# EAGLE schematic MTC2-N9151-BRK rev2-2 (Eagle) (EAGLE 7.5.0)
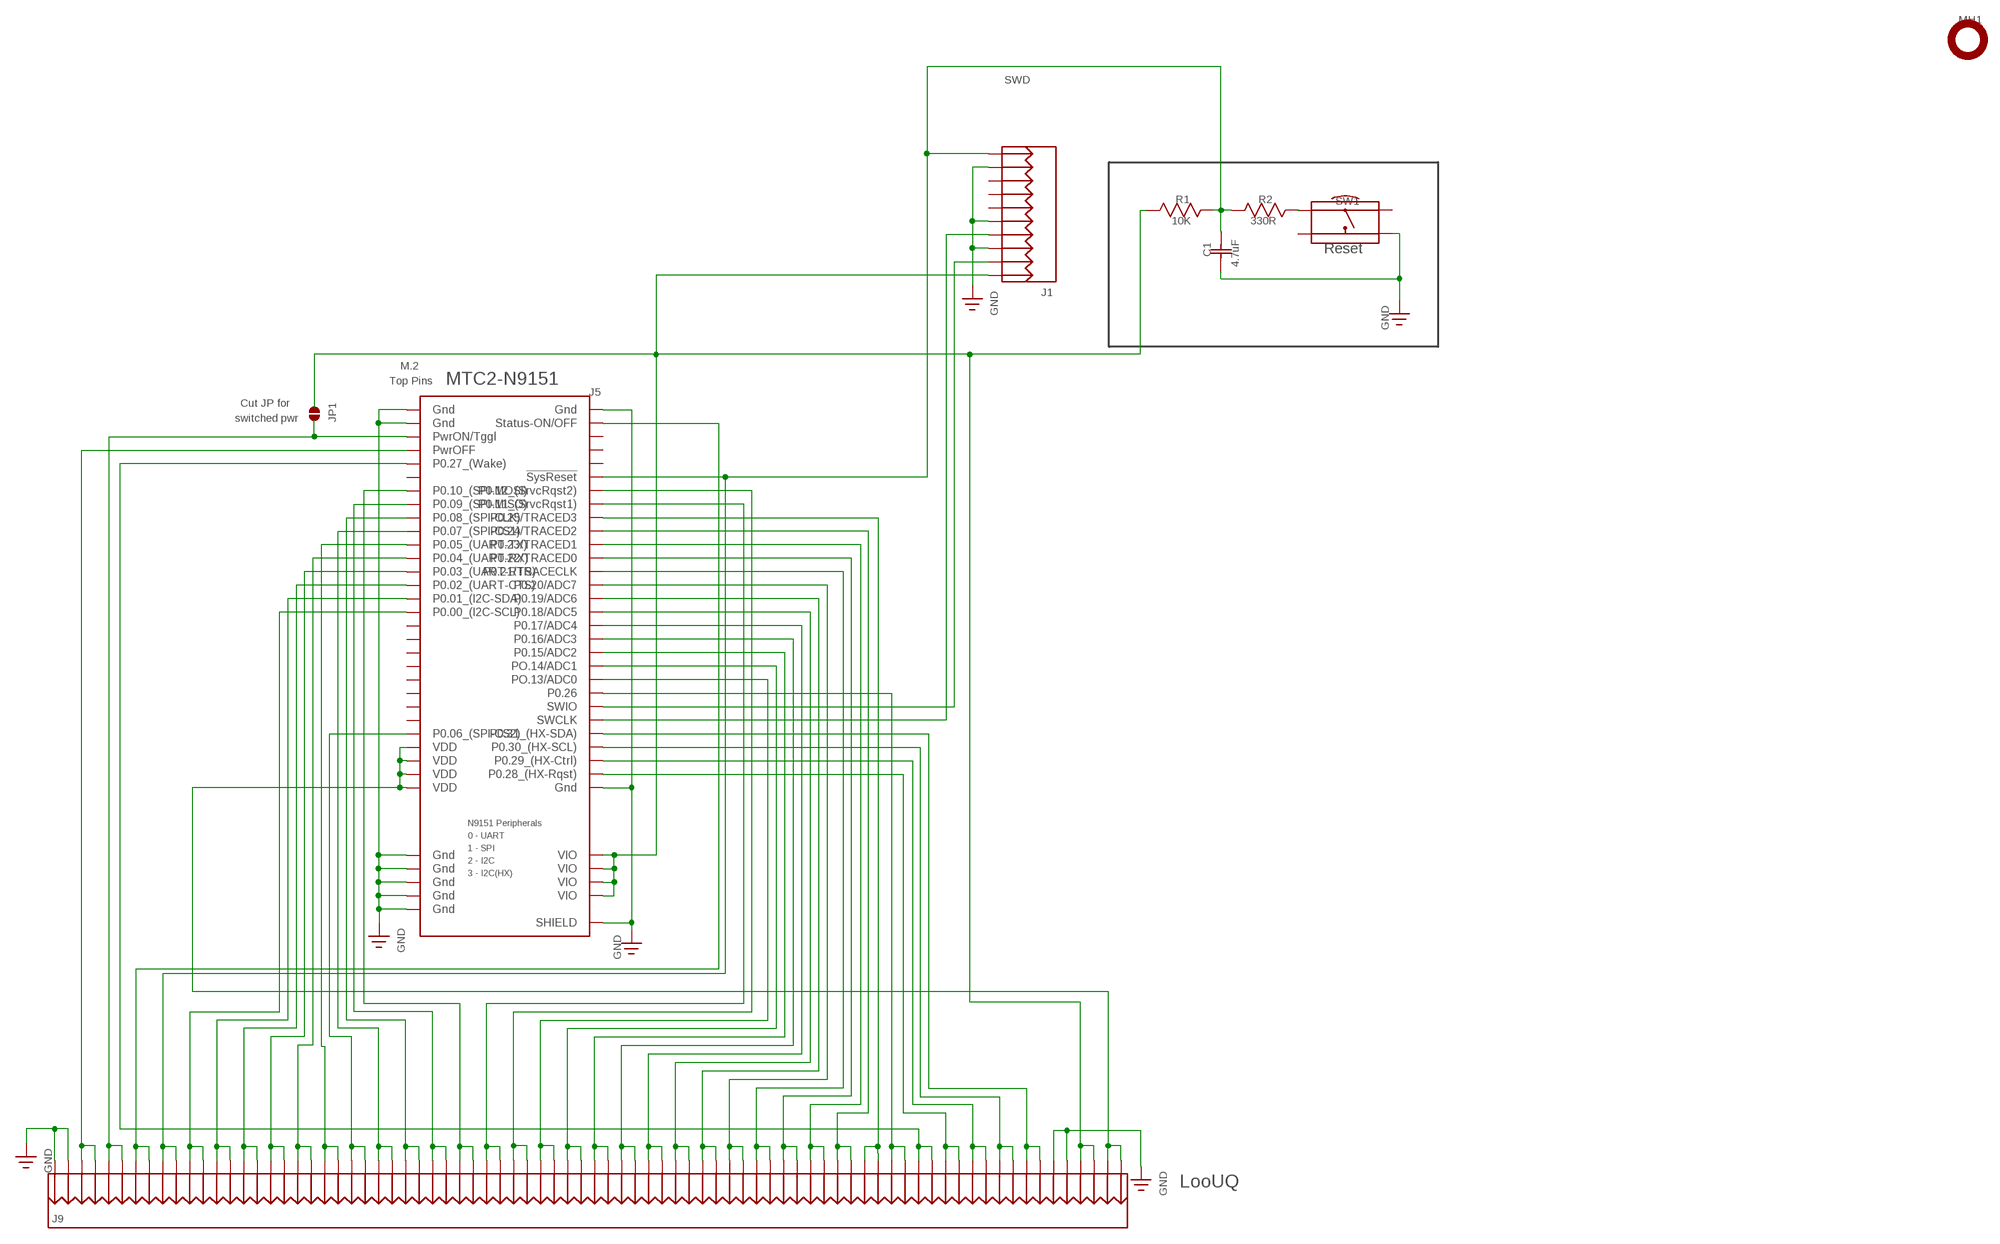
[diagram p0: schematic, sheet 1]

## Parts
C1  4.7uF  CL10A475KP8NNNC  [CAP_0603]
J1  CNCTECH_3220-10-0300-00-TR  [CNCTECH_3220-10-0300-00-TR]
J5  MTC.2_1-2199230-6_(N9151)  [TE_1-2199230-6]
J9  90131-0160  [HDR-2X40T/2.54X2.54/102X5]
JP1  CIRCJUMPER-2  [CIRC-JUMPER-2]
LG1  LOOUQ_LOGO  [LOOUQ-6MM]
MH1  9774025151R  [M.2_STANDOFF]
R1  10K  RNCP0603FTD10K0  [RES_0603]
R2  330R  WR06X3300FTL  [RES_0603]
SW1  KMR221GLFS  [KMR-2-WG]

## Nets
ND_RESETSW: R2.2 SW1.1@_1
Net_GND: C1.1 J1.3 J1.5 J1.9 J5.1(Gnd) J5.2(Gnd) J5.3(Gnd) J5.58(Gnd) J5.67(Gnd) J5.69(Gnd) J5.71(Gnd) J5.73(Gnd) J5.75(Gnd) J5.S1(SHIELD) J5.S2(SHIELD) J9.1 J9.2 J9.75 J9.76 SW1.2@_1 ; supply symbol labelled GND
Net_PWR-TGL: J5.5(PwrON/Tggl) J9.5 J9.6 JP1.1
Net_SWCLK: J1.4 J5.48(SWCLK)
Net_SWIO: J1.2 J5.46(SWIO)
Net_VDD: J5.51(VDD) J5.53(VDD) J5.55(VDD) J5.57(VDD) J9.79 J9.80
Net_VIO [NetClass2]: J1.1 J5.68(VIO) J5.70(VIO) J5.72(VIO) J5.74(VIO) J9.77 J9.78 JP1.2 R1.2
nSysReset: C1.2 J1.10 J5.12(!SysReset) J9.9 J9.10 R1.1 R2.1
P0.01_(I2C-SCL): J5.31(P0.00_(I2C-SCL)) J9.11 J9.12
P0.01_(I2C-SDA): J5.29(P0.01_(I2C-SDA)) J9.13 J9.14
P0.02_(UART-CTS): J5.27(P0.02_(UART-CTS)) J9.15 J9.16
P0.03_(UART-RTS): J5.25(P0.03_(UART-RTS)) J9.17 J9.18
P0.04_(UART-RX): J5.23(P0.04_(UART-RX)) J9.19 J9.20
P0.05_(UART-TX): J5.21(P0.05_(UART-TX)) J9.21 J9.22
P0.06_(SPI-CS2): J5.49(P0.06_(SPI-CS2)) J9.23 J9.24
P0.07_(SPI-CS1): J5.19(P0.07_(SPI-CS1)) J9.25 J9.26
P0.08_(SPI-CLK): J5.17(P0.08_(SPI-CLK)) J9.27 J9.28
P0.09_(SPI-MISO): J5.15(P0.09_(SPI-MISO)) J9.29 J9.30
P0.10_(SPI-MOSI): J5.13(P0.10_(SPI-MOSI)) J9.31 J9.32
P0.11_(nSrvcRqst1): J5.16(P0.11_(SrvcRqst1)) J9.33 J9.34
P0.12_(nSrvcRqst2): J5.14(P0.12_(SrvcRqst2)) J9.35 J9.36
P0.13/ADC0: J5.42(PO.13/ADC0) J9.37 J9.38
P0.14/ADC1: J5.40(PO.14/ADC1) J9.39 J9.40
P0.15/ADC2: J5.38(P0.15/ADC2) J9.41 J9.42
P0.16/ADC3: J5.36(P0.16/ADC3) J9.43 J9.44
P0.17/ADC4: J5.34(P0.17/ADC4) J9.45 J9.46
P0.18/ADC5: J5.32(P0.18/ADC5) J9.47 J9.48
P0.19/ADC6: J5.30(P0.19/ADC6) J9.49 J9.50
P0.20/ADC7: J5.28(P0.20/ADC7) J9.51 J9.52
P0.21/TRACECLK: J5.26(P0.21/TRACECLK) J9.53 J9.54
P0.22/TRACED0: J5.24(P0.22/TRACED0) J9.55 J9.56
P0.23/TRACED1: J5.22(P0.23/TRACED1) J9.57 J9.58
P0.24/TRACED2: J5.20(P0.24/TRACED2) J9.59 J9.60
P0.25/TRACED3: J5.18(P0.25/TRACED3) J9.61 J9.62
P0.26: J5.44(P0.26) J9.63 J9.64
P0.27_(Wake): J5.9(P0.27_(Wake)) J9.65 J9.66
P0.28_(HX-Rqst): J5.56(P0.28_(HX-Rqst)) J9.67 J9.68
P0.29_(HX-Ctrl): J5.54(P0.29_(HX-Ctrl)) J9.69 J9.70
P0.30_HX-SCL: J5.52(P0.30_(HX-SCL)) J9.71 J9.72
P0.31_HX-SDA: J5.50(P0.31_(HX-SDA)) J9.73 J9.74
PWR-OFF: J5.7(PwrOFF) J9.3 J9.4
Status-ON/OFF: J5.4(Status-ON/OFF) J9.7 J9.8
Unconnected: J1.6 J1.7 J1.8 J5.6(Status-Rdy) J5.8(StatusActv0) J5.10(StatusActv1) J5.11 J5.33(UDPIN0) J5.35(UDPIN1) J5.37(UDPIN2) J5.39(UDPIN3) J5.41(UDPIN4) J5.43(UDPIN5) J5.45(UDPIN6) J5.47(UDPIN7) SW1.1@_1 SW1.2@_1

## Notes on the sheet
- MH1
- SWD
- R1 | R2 | SW1
- 10K | 330R
- Reset
- C1
- 4.7uF
- J1
- GND
- GND
- M.2 
  Top Pins
- MTC2-N9151
- J5
- Cut JP for 
  switched pwr
- JP1
- N9151 Peripherals
  0 - UART
  1 - SPI
  2 - I2C
  3 - I2C(HX)
- GND
- GND
- GND | LooUQ
- GND
- J9

## Library data of the parts
C1 = common:CL10A475KP8NNNC; MANUFACTURER: Samsung; MFGPARTNM: CAP CER 4.7UF 10V X5R 0603
J1 = common:CNCTECH_3220-10-0300-00-TR; MANUFACTURER: CnCTech
J5 = common:MTC.2_1-2199230-6_(N9151); DATASHEET: https://www.te.com/commerce/DocumentDelivery/DDEController?Action=srchrtrv&DocNm=1-1773702-1NGFFQRG-EN&DocType=Data%20Sheet&DocLang=English&DocFormat=pdf&PartCntxt=1-2199230-6; DESCRIPTION: 67 Position Female Connector M.2 (NGFF) Mini Card Gold 0.020 (0.50mm) Black; MANUFACTURER: TE Connectivity
J9 = common:90131-0160; DATASHEET: http://datasheets.diptrace.com/con_headers/901310126_sd.pdf; MANUFACTURER: Molex
JP1 = common:CIRCJUMPER-2; MOUNT: TR
LG1 = common:LOOUQ_LOGO; DESCRIPTION: LooUQ logo silk; MANUFACTURER: PCB; MOUNT: SLK
MH1 = common:9774025151R; DATASHEET: https://www.we-online.com/components/products/datasheet/9774025151R.pdf; MANUFACTURER: Wurth
R1 = common:RNCP0603FTD10K0; MANUFACTURER: Stackpole
R2 = common:WR06X3300FTL; MANUFACTURER: Walsin Technology
SW1 = common:KMR221GLFS; CLASS: Switch; DATASHEET: https://www.ckswitches.com/media/1479/kmr2.pdf; DESCRIPTION: Tactile Switch SPST-NO Top Actuated Surface Mount, GndPin, 300gf; MANUFACTURER: C&K

## Net classes
0 Default: width 0.18 mm, clearance 0.2 mm
1 Power: width 0.4 mm, clearance 0.2 mm
2 NetClass2: width 0.3 mm, clearance 0.2 mm
3 Power-HI: width 0.6 mm, clearance 0.2 mm